# EAGLE design fireboy_yun (EAGLE 7.5.0)
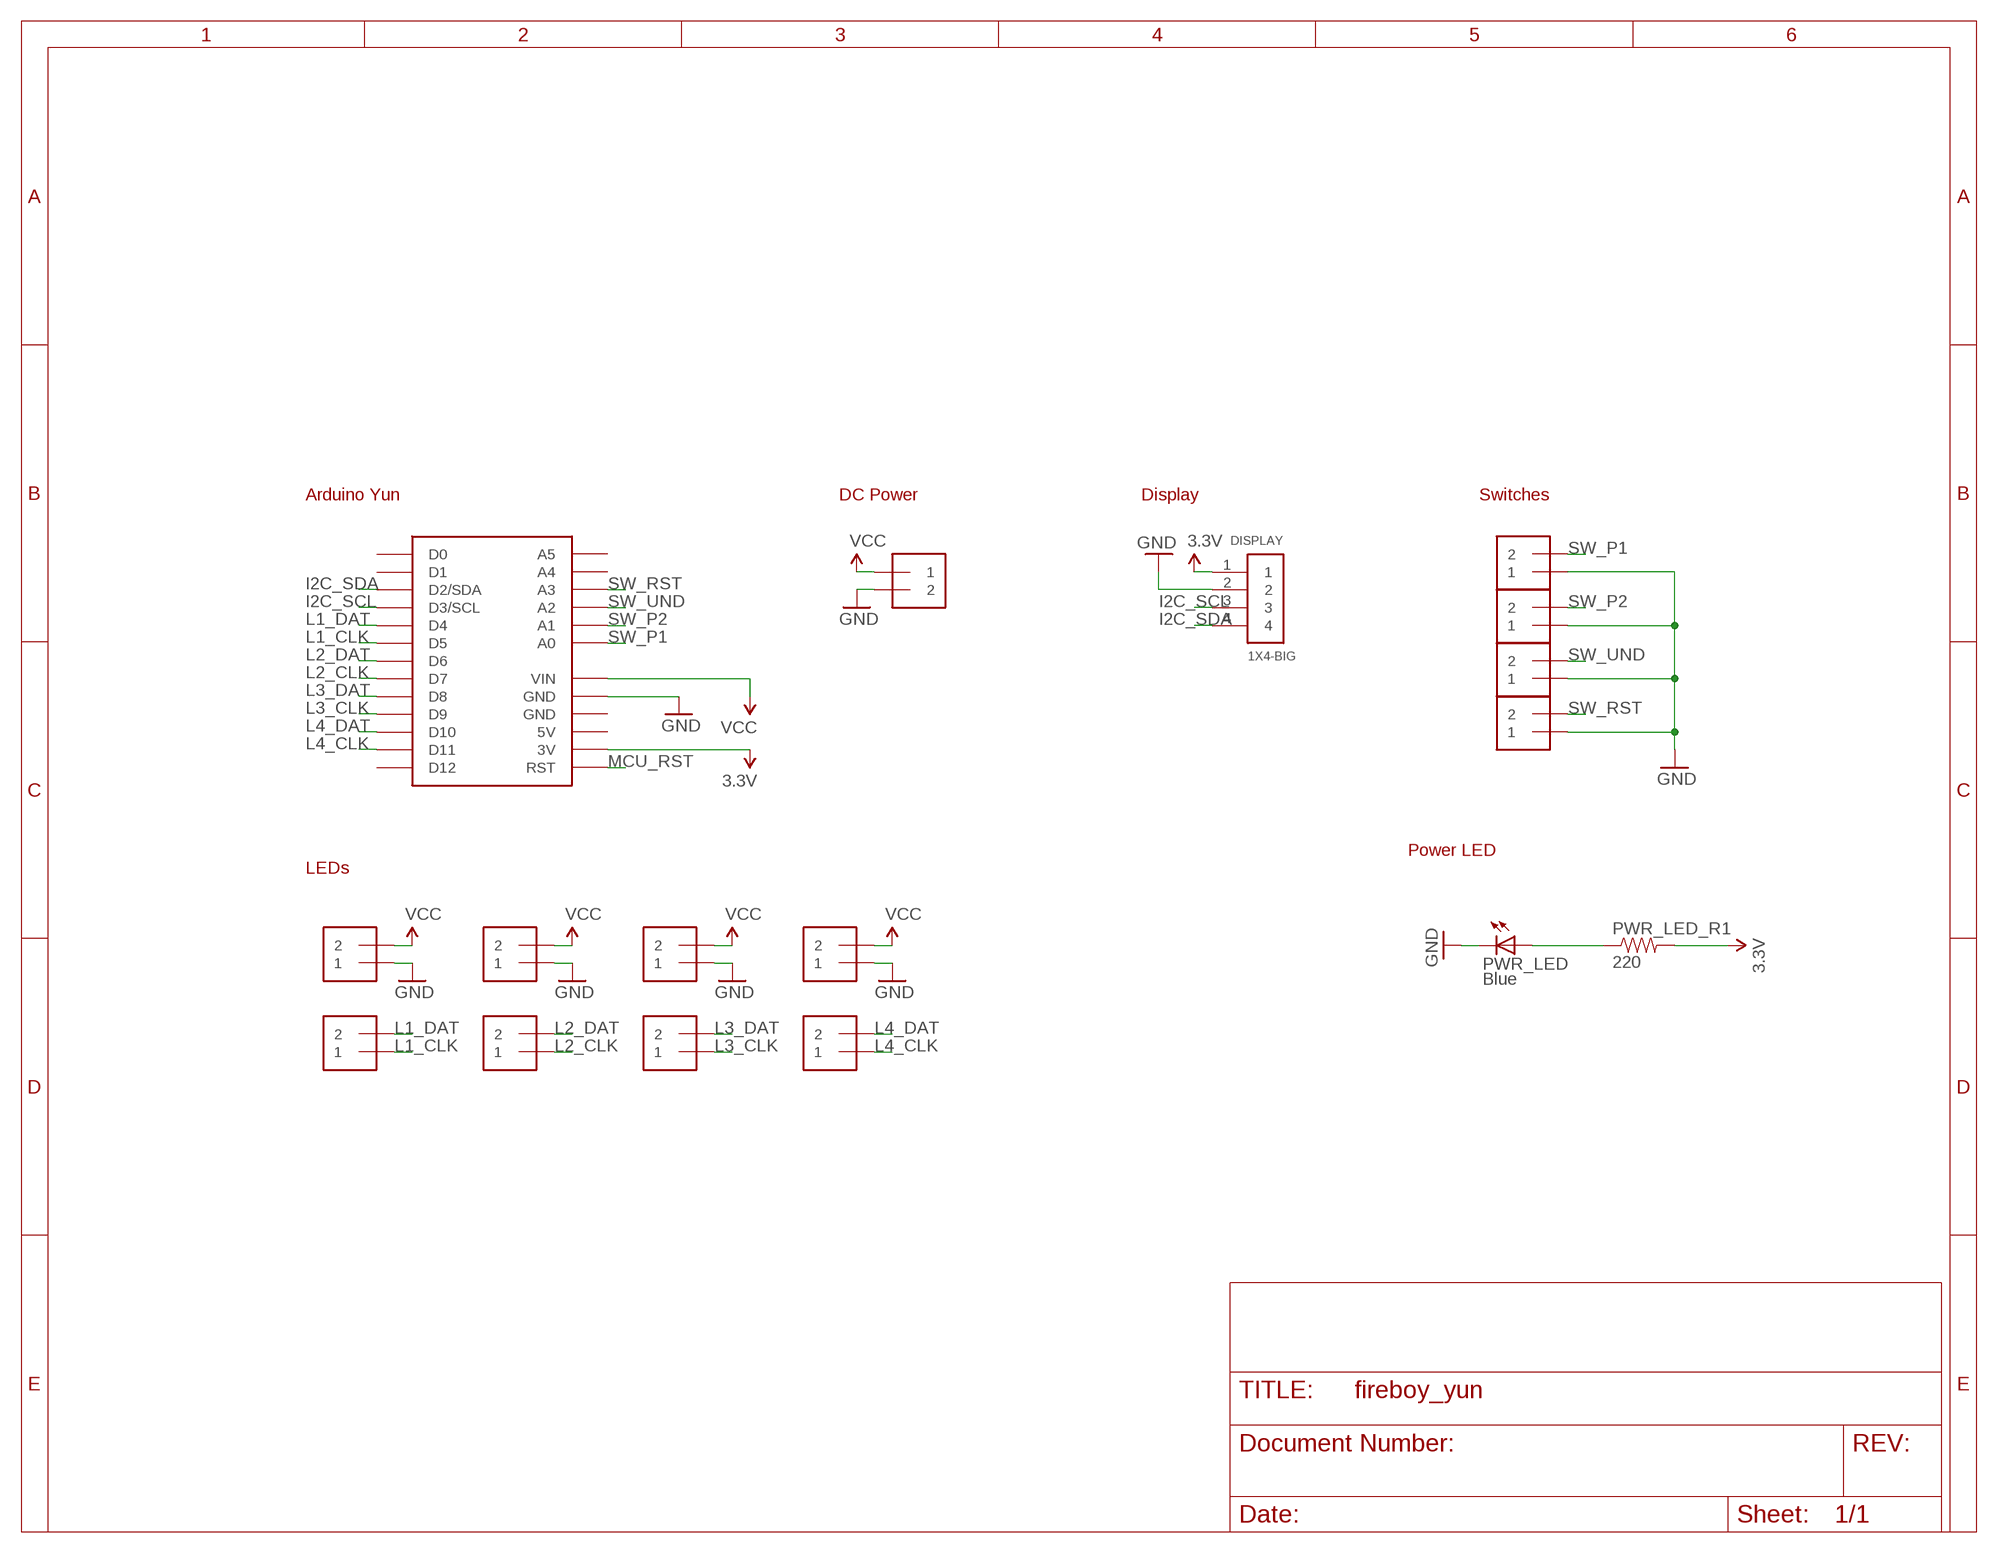
[diagram p0: schematic, sheet 1]

## Parts
DC_5V_8A  1X2-3.5MM  [1X2-3.5MM]
DISPLAY  1X4-BIG  [1X04-BIG]
L1_IO  1X2-3.5MM  [1X2-3.5MM]
L1_PWR  1X2-3.5MM  [1X2-3.5MM]
L2_IO  1X2-3.5MM  [1X2-3.5MM]
L2_PWR  1X2-3.5MM  [1X2-3.5MM]
L3_IO  1X2-3.5MM  [1X2-3.5MM]
L3_PWR  1X2-3.5MM  [1X2-3.5MM]
L4_IO  1X2-3.5MM  [1X2-3.5MM]
L4_PWR  1X2-3.5MM  [1X2-3.5MM]
PWR_LED  Blue  LED3MM  [LED3MM]
PWR_LED_R1  220  100OHM-1/4W-5%(PTH)  [AXIAL-0.3]
SW_P1  1X2-3.5MM  [1X2-3.5MM]
SW_P2  1X2-3.5MM  [1X2-3.5MM]
SW_RST  1X2-3.5MM  [1X2-3.5MM]
SW_UND  1X2-3.5MM  [1X2-3.5MM]
YUN  YUN_MINI_SHIELD-BPLACE  [YUN_MINI_SHIELD]

## Nets
3.3V: DISPLAY.1 PWR_LED_R1.P$2 YUN.3V
GND: DC_5V_8A.2 DISPLAY.2 L1_PWR.1 L2_PWR.1 L3_PWR.1 L4_PWR.1 PWR_LED.K(C) SW_P1.1 SW_P2.1 SW_RST.1 SW_UND.1 YUN.GND1(GND)
I2C_SCL: DISPLAY.3 YUN.D3(D3/SCL)
I2C_SDA: DISPLAY.4 YUN.D2(D2/SDA)
L1_CLK: L1_IO.1 YUN.D5
L1_DAT: L1_IO.2 YUN.D4
L2_CLK: L2_IO.1 YUN.D7
L2_DAT: L2_IO.2 YUN.D6
L3_CLK: L3_IO.1 YUN.D9
L3_DAT: L3_IO.2 YUN.D8
L4_CLK: L4_IO.1 YUN.D11
L4_DAT: L4_IO.2 YUN.D10
MCU_RST: YUN.RESET(RST)
PWR_LED_R: PWR_LED.A PWR_LED_R1.P$1
SW_P1: SW_P1.2 YUN.A0
SW_P2: SW_P2.2 YUN.A1
SW_RST: SW_RST.2 YUN.A3
SW_UND: SW_UND.2 YUN.A2
VCC: DC_5V_8A.1 L1_PWR.2 L2_PWR.2 L3_PWR.2 L4_PWR.2 YUN.VIN
Unconnected: YUN.A4 YUN.A5 YUN.D0 YUN.D1 YUN.D12

## Notes on the sheet
- Arduino Yun | DC Power | Display | Switches
- Power LED
- LEDs

## Power pins joined to a net without a drawn wire
5V: YUN.5V
GND: YUN.GND2(GND)

## Library data of the parts
DC_5V_8A L1_IO L1_PWR L2_IO L2_PWR L3_IO L3_PWR L4_IO L4_PWR SW_P1 SW_P2 SW_RST SW_UND = adafruit:1X2: 3.5mm Terminal block http://www.ladyada.net/library/pcb/eaglelibrary.html
DISPLAY = adafruit:1X4: 4-pin connector
PWR_LED = adafruit:LED: LED OSRAM: - CHIPLED LG R971, LG N971, LY N971, LG Q971, LY Q971, LO R971, LY R971 LH N974, LH R974 LS Q976, LO Q976, LY Q976 LO Q996 - Hyper CHIPLED LW Q18S LB Q993, LB Q99A, LB R99A - SideLED LS A670, LO A670, LY A670, LG A670, LP A670 LB A673, LV A673, LT A673, LW A673 LH A674 LY A675 LS A676, LA A676, LO A676, LY A676, LW A676 LS A679, LY A679, LG A679 - Hyper Micro SIDELED® LS Y876, LA Y876, LO Y876, LY Y876 LT Y87S - SmartLED LW L88C, LW L88S LB L89C, LB L89S, LG L890 LS L89K, LO L89K, LY L89K LS L896, LA L896, LO L896, LY L896 - TOPLED LS T670, LO T670, LY T670, LG T670, LP T670 LSG T670, LSP T670, LSY T670, LOP T670, LYG T670 LG T671, LOG T671, LSG T671 LB T673, LV T673, LT T673, LW T673 LH T674 LS T676, LA T676, LO T676, LY T676, LB T676, LH T676, LSB T676, LW T676 LB T67C, LV T67C, LT T67C, LS T67K, LO T67K, LY T67K, LW E67C LS E67B, LA E67B, LO E67B, LY E67B, LB E67C, LV E67C, LT E67C LW T67C LS T679, LY T679, LG T679 LS T770, LO T770, LY T770, LG T770, LP T770 LB T773, LV T773, LT T773, LW T773 LH T774 LS E675, LA E675, LY E675, LS T675 LS T776, LA T776, LO T776, LY T776, LB T776 LHGB T686 LT T68C, LB T68C - Hyper Mini TOPLED® LB M676 - Mini TOPLED Santana® LG M470 LS M47K, LO M47K, LY M47K Source: http://www.osram.convergy.de/
PWR_LED_R1 = SparkFun-Resistors:100OHM-1/4W-5%(PTH): RES-08059; PROD_ID: RES-08059; VALUE: 100
YUN = yun_mini_shield:YUN_MINI_SHIELD: Arduino YUN mini shield. Originally taken from Adafruit's UNO R3 shield.

## Board
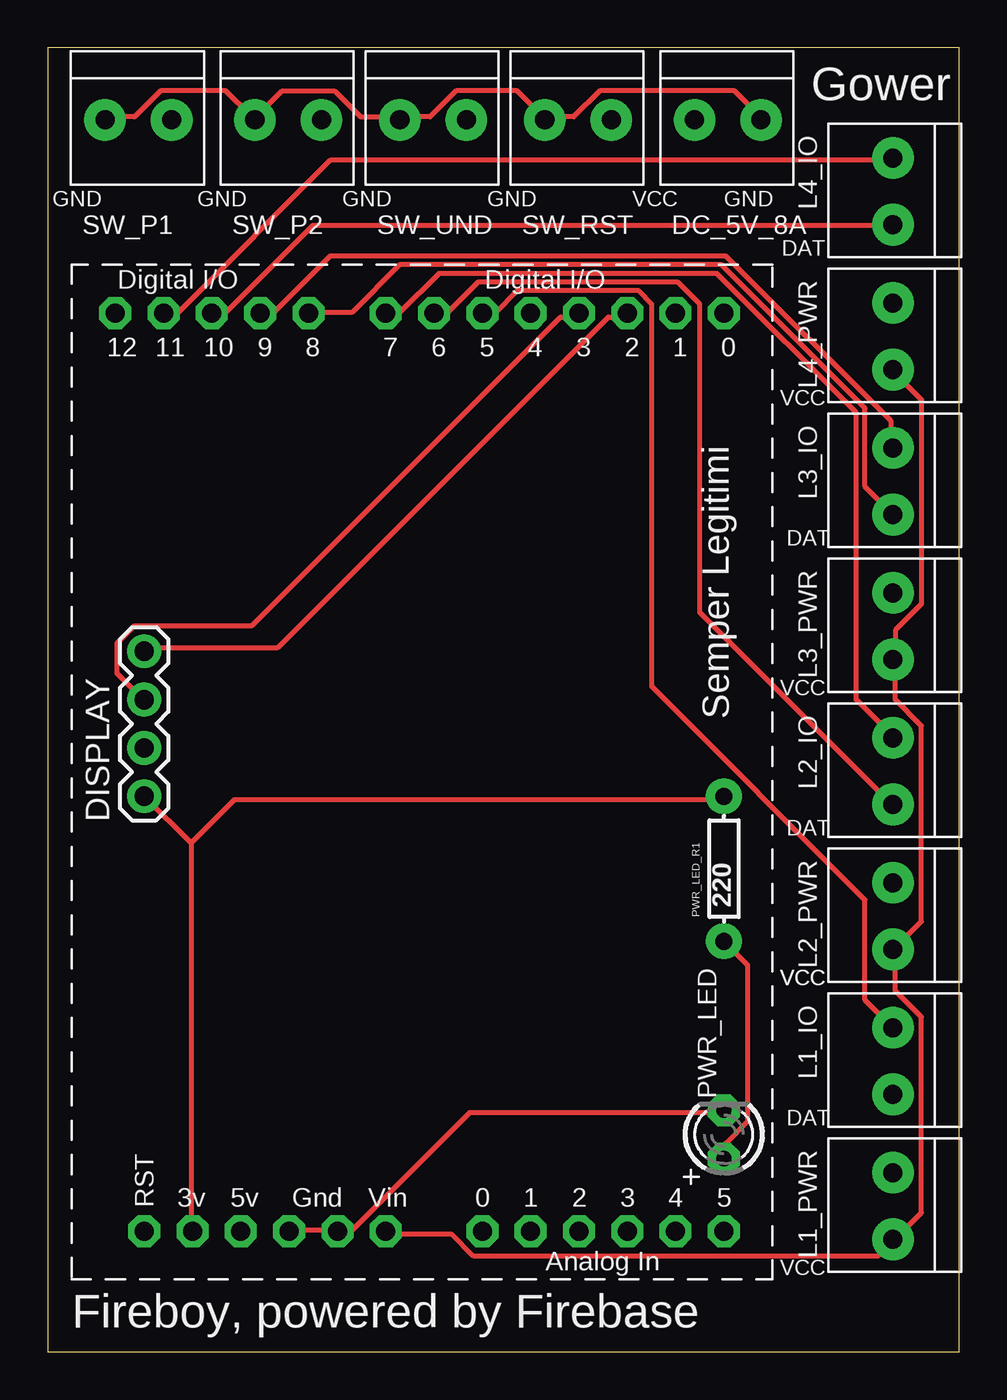
[diagram p1: board, top side]
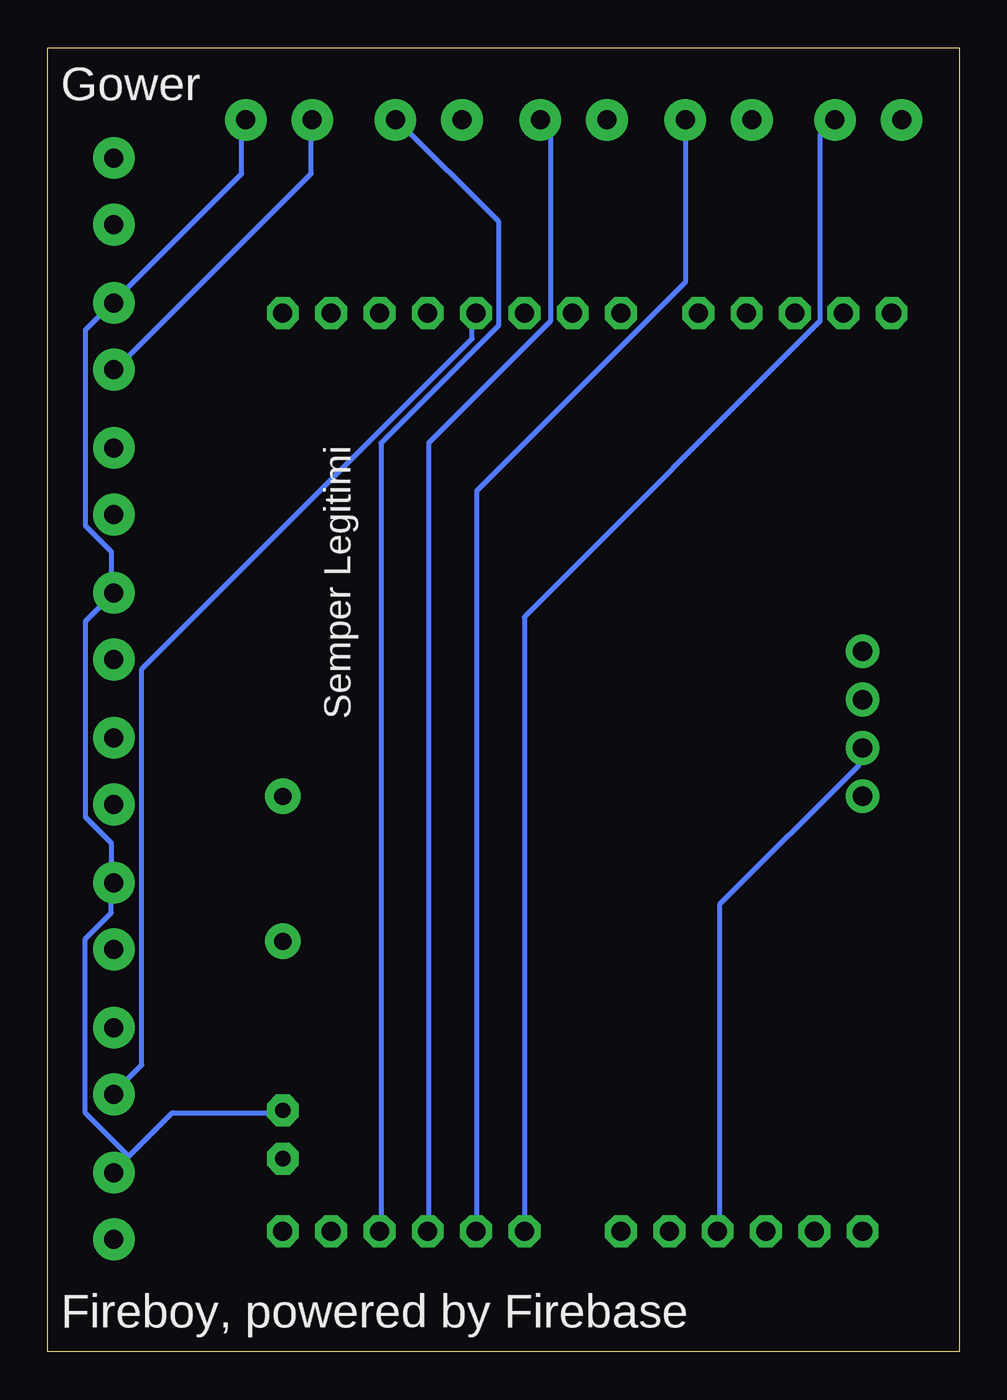
[diagram p2: board, bottom side, seen from below]

Size 47.93 x 68.57 mm. Coordinates in mm from the lower left corner, seen from the top.
Outline: 0,0 47.93,0 47.93,68.57 0,68.57 0,0
Copper layers (1*16): Top 0.035mm / dielectric 1.5mm / Bottom 0.035mm
Design rules "default": minimum track width 10mil, minimum drill 24mil, track to track 8mil, track to pad 8mil, pad to pad 8mil, via to via 8mil, smd to smd 8mil, copper to edge 40mil, drill to drill 8mil, minimum pad ring 10mil, minimum via ring 8mil, stop-mask expansion 4mil, vias tented up to drill 0mil, thermal gap 10mil

### Footprints (pad centres in the part's own frame; a part is rotated, then mirrored left to right if it is on the bottom)
1X2-3.5MM = drill 1 pad 2.184: 1 1.8,0; 2 -1.7,0
1X04-BIG = drill 1.016 pad 1.778: 1 0,0; 2 2.54,0; 3 5.08,0; 4 7.62,0
LED3MM = drill 0.813 pad 1.676 octagon: A -1.27,0; K 1.27,0
AXIAL-0.3 = drill 0.9 pad 1.88: P$1 -3.81,0; P$2 3.81,0
YUN_MINI_SHIELD = drill 1 pad 1.676 octagon: 3V 6.35,2.54; 5V 8.89,2.54; A0 21.59,2.54; A1 24.13,2.54; A2 26.67,2.54; A3 29.21,2.54; A4 31.75,2.54; A5 34.29,2.54; D0 34.29,50.8; D1 31.75,50.8; D2 29.21,50.8; D3 26.67,50.8; D4 24.13,50.8; D5 21.59,50.8; D6 19.05,50.8; D7 16.51,50.8; D8 12.446,50.8; D9 9.906,50.8; D10 7.366,50.8; D11 4.826,50.8; D12 2.286,50.8; GND1 13.97,2.54; GND2 11.43,2.54; RESET 3.81,2.54; VIN 16.51,2.54

### Placement (x,y rotation side)
DC_5V_8A  35.81,64.77 180 top
DISPLAY  5.08,29.21 90 top
L1_IO  44.45,15.24 90 top
L1_PWR  44.45,7.62 90 top
L2_IO  44.45,30.48 90 top
L2_PWR  44.45,22.86 90 top
L3_IO  44.45,45.72 90 top
L3_PWR  44.45,38.1 90 top
L4_IO  44.45,60.96 90 top
L4_PWR  44.45,53.34 90 top
PWR_LED  35.56,11.43 90 top
PWR_LED_R1  35.56,25.4 90 top
SW_P1  4.83,64.77 180 top
SW_P2  12.7,64.77 180 top
SW_RST  27.94,64.77 180 top
SW_UND  20.32,64.77 180 top
YUN  1.27,3.81 0 top

### Tracks (layer width: path | path; a pad name or v marks a point on that pad's centre or on a via)
3.3V
  Top 0.254: 7.54,26.75 7.54,6.4 YUN.3V | DISPLAY.1 7.54,26.75 | 7.54,26.75 9.83,29.03 35.43,29.03 PWR_LED_R1.P$2
GND
  Top 0.254: YUN.GND2 12.8,6.4 15.09,6.4 YUN.GND1 15.32,6.4 16,6.4 22.17,12.57 35.43,12.57 PWR_LED.K | SW_P1.1 3.2,64.92 4.57,64.92 5.94,66.29 9.37,66.29 10.74,64.92 SW_P2.1 10.97,64.92 12.34,66.29 15.09,66.29 16.46,64.92 18.52,64.92 SW_UND.1 18.75,64.92 20.12,64.92 21.49,66.29 24.69,66.29 26.06,64.92 SW_RST.1 26.29,64.92 27.66,64.92 29.03,66.29 36.12,66.29 37.49,64.92 DC_5V_8A.2
  Bottom 0.254: DISPLAY.2 5.26,31.55 5.26,30.86 12.57,23.55 12.57,6.4 YUN.GND2 | 43.66,10.29 44.35,9.6 L1_PWR.1 | 43.66,10.29 41.38,12.57 35.66,12.57 PWR_LED.K | 43.66,10.29 45.95,12.57 45.95,21.72 44.58,23.09 44.58,24.46 L2_PWR.1 44.58,24.69 44.58,26.75 45.95,28.12 45.95,38.41 44.58,39.78 L3_PWR.1 44.58,40.01 44.58,42.06 45.95,43.43 45.95,53.72 44.58,55.09 L4_PWR.1 44.35,55.32 37.72,61.95 37.72,64.69 DC_5V_8A.2
I2C_SCL
  Top 0.254: YUN.D3 27.89,54.41 26.98,54.41 10.74,38.18 4.57,38.18 3.66,37.26 3.66,35.66 5.03,34.29 DISPLAY.3
I2C_SDA
  Top 0.254: YUN.D2 30.4,54.41 29.49,54.41 12.12,37.03 5.26,37.03 DISPLAY.4
L1_CLK
  Top 0.254: YUN.D5 22.86,54.63 23.55,54.63 24.69,55.78 31.09,55.78 31.77,55.09 31.77,34.98 42.98,23.77 42.98,18.52 44.35,17.14 L1_IO.1
L1_DAT
  Bottom 0.254: YUN.D4 25.6,54.41 25.6,53.26 42.98,35.89 42.98,15.09 44.35,13.72 L1_IO.2
L2_CLK
  Top 0.254: YUN.D7 17.83,54.63 18.52,54.63 20.57,56.69 35.2,56.69 42.52,49.38 42.52,34.29 44.35,32.46 L2_IO.1
L2_DAT
  Top 0.254: YUN.D6 20.34,54.63 21.03,54.63 22.63,56.24 33.15,56.24 34.29,55.09 34.29,38.86 44.35,28.8 L2_IO.2
L3_CLK
  Top 0.254: YUN.D9 11.2,54.63 11.89,54.63 14.86,57.61 35.66,57.61 44.35,48.92 44.35,47.55 L3_IO.1
L3_DAT
  Top 0.254: YUN.D8 13.72,54.63 16,54.63 18.52,57.15 35.43,57.15 42.98,49.61 42.98,45.49 44.35,44.12 L3_IO.2
L4_CLK
  Top 0.254: YUN.D11 6.17,54.63 6.86,54.63 14.86,62.64 44.35,62.64 L4_IO.1
L4_DAT
  Top 0.254: YUN.D10 8.69,54.63 9.37,54.63 13.95,59.21 44.35,59.21 L4_IO.2
PWR_LED_R
  Top 0.254: PWR_LED_R1.P$1 36.8,20.34 36.8,12.12 35.66,10.97 35.66,10.29 PWR_LED.A
SW_P1
  Bottom 0.254: YUN.A0 22.86,38.63 7.32,54.18 7.32,64.01 6.63,64.69 SW_P1.2
SW_P2
  Bottom 0.254: YUN.A1 25.38,6.4 25.38,45.26 14.4,56.24 14.4,64.69 SW_P2.2
SW_RST
  Bottom 0.254: YUN.A3 30.4,6.4 30.4,47.78 24.23,53.95 24.23,59.44 29.49,64.69 SW_RST.2
SW_UND
  Bottom 0.254: YUN.A2 27.89,6.4 27.89,47.78 21.49,54.18 21.49,64.24 21.95,64.69 SW_UND.2
VCC
  Top 0.254: L4_PWR.2 44.58,51.44 45.95,50.06 45.95,39.32 44.58,37.95 44.58,36.58 L3_PWR.2 44.58,36.35 44.58,34.29 45.95,32.92 45.95,22.63 44.58,21.26 L2_PWR.2 44.58,21.03 44.58,18.97 45.95,17.6 45.95,7.32 44.58,5.94 L1_PWR.2 44.35,5.71 43.66,5.03 22.4,5.03 21.26,6.17 17.83,6.17 YUN.VIN
  Bottom 0.254: DC_5V_8A.1 34.06,64.69 34.06,61.95 44.35,51.66 L4_PWR.2

### Text on the board
tPlace: Gower | GND | GND | GND | GND | VCC | GND | DAT | VCC | DAT | VCC | Semper Legitimi | DAT | VCC | VCC | DAT | VCC | Fireboy, powered by Firebase
bPlace: Gower | Semper Legitimi | Fireboy, powered by Firebase